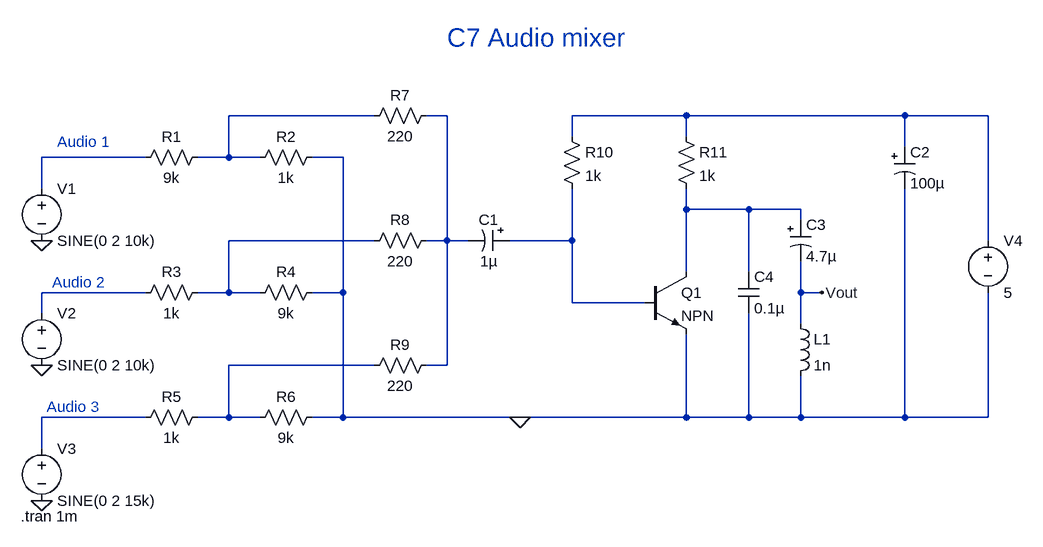
[diagram p0: schematic Audio mixer .asc]
Audio mixer .asc, the LTspice schematic file:
Version 4
SHEET 1 1432 680
WIRE 432 -96 208 -96
WIRE 544 -96 512 -96
WIRE 912 -96 736 -96
WIRE 1248 -96 912 -96
WIRE 1376 -96 1248 -96
WIRE 736 -64 736 -96
WIRE 912 -64 912 -96
WIRE 1248 -48 1248 -96
WIRE 80 -32 -80 -32
WIRE 208 -32 208 -96
WIRE 208 -32 160 -32
WIRE 256 -32 208 -32
WIRE 384 -32 336 -32
WIRE -80 16 -80 -32
WIRE 912 48 912 16
WIRE 1008 48 912 48
WIRE 1088 48 1008 48
WIRE 1088 64 1088 48
WIRE 432 96 208 96
WIRE 544 96 544 -96
WIRE 544 96 512 96
WIRE 576 96 544 96
WIRE 736 96 736 16
WIRE 736 96 640 96
WIRE 1376 96 1376 -96
WIRE 912 144 912 48
WIRE 1008 144 1008 48
WIRE 80 176 -80 176
WIRE 208 176 208 96
WIRE 208 176 160 176
WIRE 256 176 208 176
WIRE 384 176 384 -32
WIRE 384 176 336 176
WIRE 1088 176 1088 128
WIRE 1120 176 1088 176
WIRE 736 192 736 96
WIRE 848 192 736 192
WIRE -80 208 -80 176
WIRE 1088 224 1088 176
WIRE 432 288 208 288
WIRE 544 288 544 96
WIRE 544 288 512 288
WIRE 80 368 -80 368
WIRE 208 368 208 288
WIRE 208 368 160 368
WIRE 256 368 208 368
WIRE 384 368 384 176
WIRE 384 368 336 368
WIRE 656 368 384 368
WIRE 912 368 912 240
WIRE 912 368 656 368
WIRE 1008 368 1008 208
WIRE 1008 368 912 368
WIRE 1088 368 1088 304
WIRE 1088 368 1008 368
WIRE 1248 368 1248 16
WIRE 1248 368 1088 368
WIRE 1376 368 1376 176
WIRE 1376 368 1248 368
WIRE -80 416 -80 368
FLAG -80 96 0
FLAG -80 288 0
FLAG -80 496 0
FLAG 656 368 0
FLAG 1120 176 Vout
SYMBOL voltage -80 0 R0
WINDOW 123 0 0 Left 0
WINDOW 39 0 0 Left 0
SYMATTR InstName V1
SYMATTR Value SINE(0 2 10k)
SYMBOL voltage -80 192 R0
WINDOW 123 0 0 Left 0
WINDOW 39 0 0 Left 0
SYMATTR InstName V2
SYMATTR Value SINE(0 2 10k)
SYMBOL voltage -80 400 R0
WINDOW 123 0 0 Left 0
WINDOW 39 0 0 Left 0
SYMATTR InstName V3
SYMATTR Value SINE(0 2 15k)
SYMBOL res 176 -48 R90
WINDOW 0 0 56 VBottom 2
WINDOW 3 32 56 VTop 2
SYMATTR InstName R1
SYMATTR Value 9k
SYMBOL res 352 -48 R90
WINDOW 0 0 56 VBottom 2
WINDOW 3 32 56 VTop 2
SYMATTR InstName R2
SYMATTR Value 1k
SYMBOL res 176 160 R90
WINDOW 0 0 56 VBottom 2
WINDOW 3 32 56 VTop 2
SYMATTR InstName R3
SYMATTR Value 1k
SYMBOL res 352 160 R90
WINDOW 0 0 56 VBottom 2
WINDOW 3 32 56 VTop 2
SYMATTR InstName R4
SYMATTR Value 9k
SYMBOL res 176 352 R90
WINDOW 0 0 56 VBottom 2
WINDOW 3 32 56 VTop 2
SYMATTR InstName R5
SYMATTR Value 1k
SYMBOL res 352 352 R90
WINDOW 0 0 56 VBottom 2
WINDOW 3 32 56 VTop 2
SYMATTR InstName R6
SYMATTR Value 9k
SYMBOL res 528 -112 R90
WINDOW 0 0 56 VBottom 2
WINDOW 3 32 56 VTop 2
SYMATTR InstName R7
SYMATTR Value 220
SYMBOL res 528 80 R90
WINDOW 0 0 56 VBottom 2
WINDOW 3 32 56 VTop 2
SYMATTR InstName R8
SYMATTR Value 220
SYMBOL res 528 272 R90
WINDOW 0 0 56 VBottom 2
WINDOW 3 32 56 VTop 2
SYMATTR InstName R9
SYMATTR Value 220
SYMBOL polcap 640 80 R90
WINDOW 0 0 32 VBottom 2
WINDOW 3 32 32 VTop 2
SYMATTR InstName C1
SYMATTR Value 1µ
SYMBOL res 720 -80 R0
SYMATTR InstName R10
SYMATTR Value 1k
SYMBOL res 896 -80 R0
SYMATTR InstName R11
SYMATTR Value 1k
SYMBOL polcap 1232 -48 R0
SYMATTR InstName C2
SYMATTR Value 100µ
SYMBOL polcap 1072 64 R0
SYMATTR InstName C3
SYMATTR Value 4.7µ
SYMBOL npn 848 144 R0
SYMATTR InstName Q1
SYMBOL ind 1072 208 R0
SYMATTR InstName L1
SYMATTR Value 1n
SYMBOL voltage 1376 80 R0
WINDOW 123 0 0 Left 0
WINDOW 39 0 0 Left 0
SYMATTR InstName V4
SYMATTR Value 5
SYMBOL cap 992 144 R0
SYMATTR InstName C4
SYMATTR Value 0.1µ
TEXT -112 520 Left 2 !.tran 1m
TEXT 544 -216 Left 4 ;C7 Audio mixer
TEXT -56 -56 Left 2 ;Audio 1
TEXT -64 160 Left 2 ;Audio 2
TEXT -72 352 Left 2 ;Audio 3

The netlist it stands for:
* Audio mixer .asc
V1 N004 0 SINE(0 2 10k)
V2 N008 0 SINE(0 2 10k)
V3 N010 0 SINE(0 2 15k)
R1 N001 N004 9k
R2 0 N001 1k
R3 N006 N008 1k
R4 0 N006 9k
R5 N009 N010 1k
R6 0 N009 9k
R7 N002 N001 220
R8 N002 N006 220
R9 N002 N009 220
C1 N007 N002 1µ
R10 N003 N007 1k
R11 N003 N005 1k
C2 N003 0 100µ
C3 N005 Vout 4.7µ
Q1 N005 N007 0 0 NPN
L1 Vout 0 1n
V4 N003 0 5
C4 N005 0 0.1µ
.model NPN NPN
.model PNP PNP
.lib standard.bjt
.tran 1m
* C7 Audio mixer
* Audio 1
* Audio 2
* Audio 3
.backanno
.end